# EAGLE schematic MIC ATHIdeF (EAGLE 7.6.0)
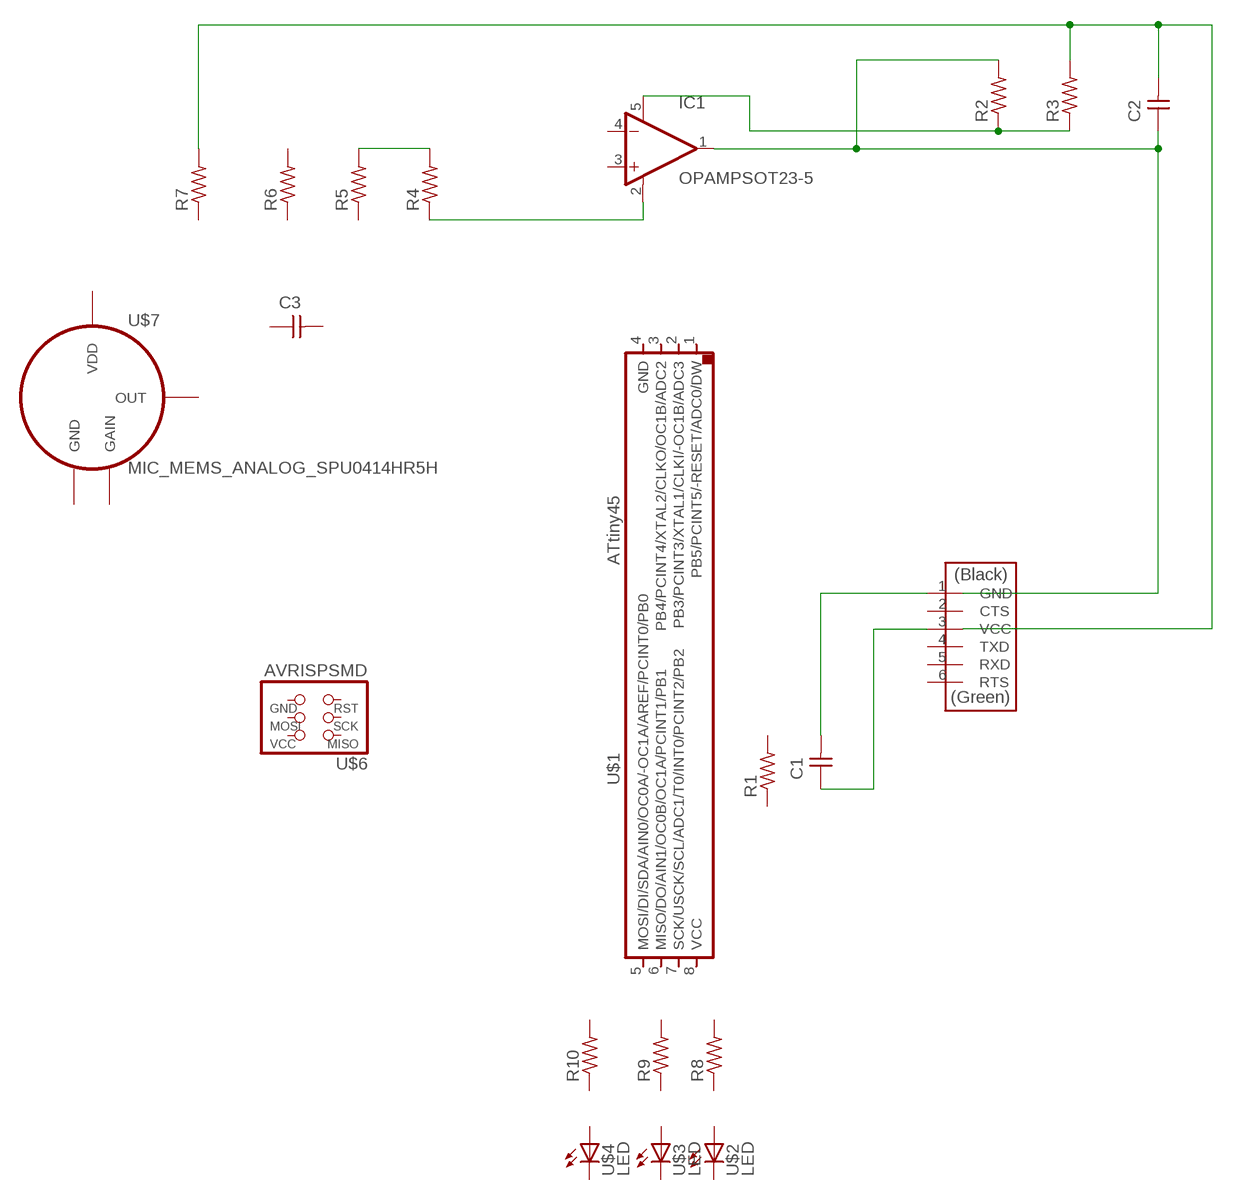
[diagram p0: schematic, sheet 1]

## Parts
C1  CAP-UNPOLARIZED  [C1206]
C2  CAP-UNPOLARIZED  [C1206]
C3  CAP-UNPOLARIZED  [C1206]
IC1  OPAMPSOT23-5  [SOT23-5]
R1  RES-US1206  [R1206]
R2  RES-US1206  [R1206]
R3  RES-US1206  [R1206]
R4  RES-US1206  [R1206]
R5  RES-US1206  [R1206]
R6  RES-US1206  [R1206]
R7  RES-US1206  [R1206]
R8  RES-US1206  [R1206]
R9  RES-US1206  [R1206]
R10  RES-US1206  [R1206]
U$1  ATTINY45SI  [SOIC8]
U$2  LED  [LED1206]
U$3  LED  [LED1206]
U$4  LED  [LED1206]
U$5  FTDI-SMD-HEADER  [1X06SMD]
U$6  AVRISPSMD  [2X03SMD]
U$7  MIC_MEMS_ANALOG_SPU0414HR5H  [MIC_MEMS_ANALOG_SPU0414HR5H]

## Nets
N$1: C2.2 R3.2 R7.2
N$2: C1.1 U$5.3(VCC)
N$3: C1.2 U$5.1(GND)
N$4: C2.1 IC1.1(OUT) R2.2
N$5: IC1.5(V+) R2.1 R3.1
N$6: IC1.2(V-) R4.1
N$7: R4.2 R5.2
Unconnected: C3.1 C3.2 IC1.3(+IN) IC1.4(-IN) R1.1 R1.2 R5.1 R6.1 R6.2 R7.1 R8.1 R8.2 R9.1 R9.2 R10.1 R10.2 U$1.1(PB5/PCINT5/-RESET/ADC0/DW) U$1.2(PB3/PCINT3/XTAL1/CLKI/-OC1B/ADC3) U$1.3(PB4/PCINT4/XTAL2/CLKO/OC1B/ADC2) U$1.4(GND) U$1.5(MOSI/DI/SDA/AIN0/OC0A/-OC1A/AREF/PCINT0/PB0) U$1.6(MISO/DO/AIN1/OC0B/OC1A/PCINT1/PB1) U$1.7(SCK/USCK/SCL/ADC1/T0/INT0/PCINT2/PB2) U$1.8(VCC) U$2.1(A) U$2.2(C) U$3.1(A) U$3.2(C) U$4.1(A) U$4.2(C) U$5.2(CTS) U$5.4(TXD) U$5.5(RXD) U$5.6(RTS) U$6.1(MISO) U$6.2(VCC) U$6.3(SCK) U$6.4(MOSI) U$6.5(RST) U$6.6(GND) U$7.3(GAIN) U$7.4(OUT)

## Power pins joined to a net without a drawn wire
GND: U$7.2(GND)
VDD: U$7.1(VDD)

## Library data of the parts
C1-C3 = fab:CAP-UNPOLARIZED
IC1 = fab:OPAMP: Rail-to-Rail Operational Amplifiers Single-Supply, MicroAmplifier(TM) Series
R1-R10 = fab:RES-US: Resistor (US Symbol) Variants with postfix FAB are widened to allow the routing of internal traces
U$1 = fab:ATTINY45
U$2-U$4 = fab:LED: LED
U$5 = fab:FTDI-SMD-HEADER
U$6 = fab:AVRISP
U$7 = fab:MIC_MEMS_ANALOG_SPU0414HR5H